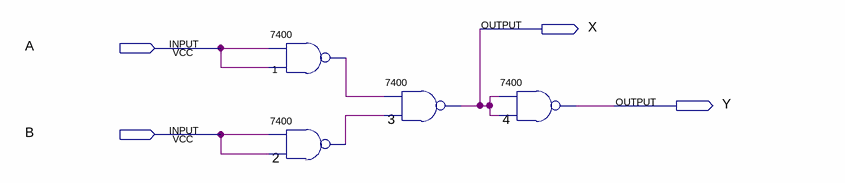
[diagram p0: schematic sheet]
// Quartus schematic Project.bdf as structural Verilog: 4 symbols, 4 pins
module Project (
  input  A,
  input  B,
  output X,
  output Y
);

  wire n1_1, n2_1;

  \7400  u_1 (.\3 (A), .\2 (A), .\1 (n1_1));
  \7400  u_2 (.\3 (B), .\2 (B), .\1 (n2_1));
  \7400  u_3 (.\3 (n2_1), .\2 (n1_1), .\1 (X));
  \7400  u_4 (.\3 (X), .\2 (X), .\1 (Y));
endmodule
